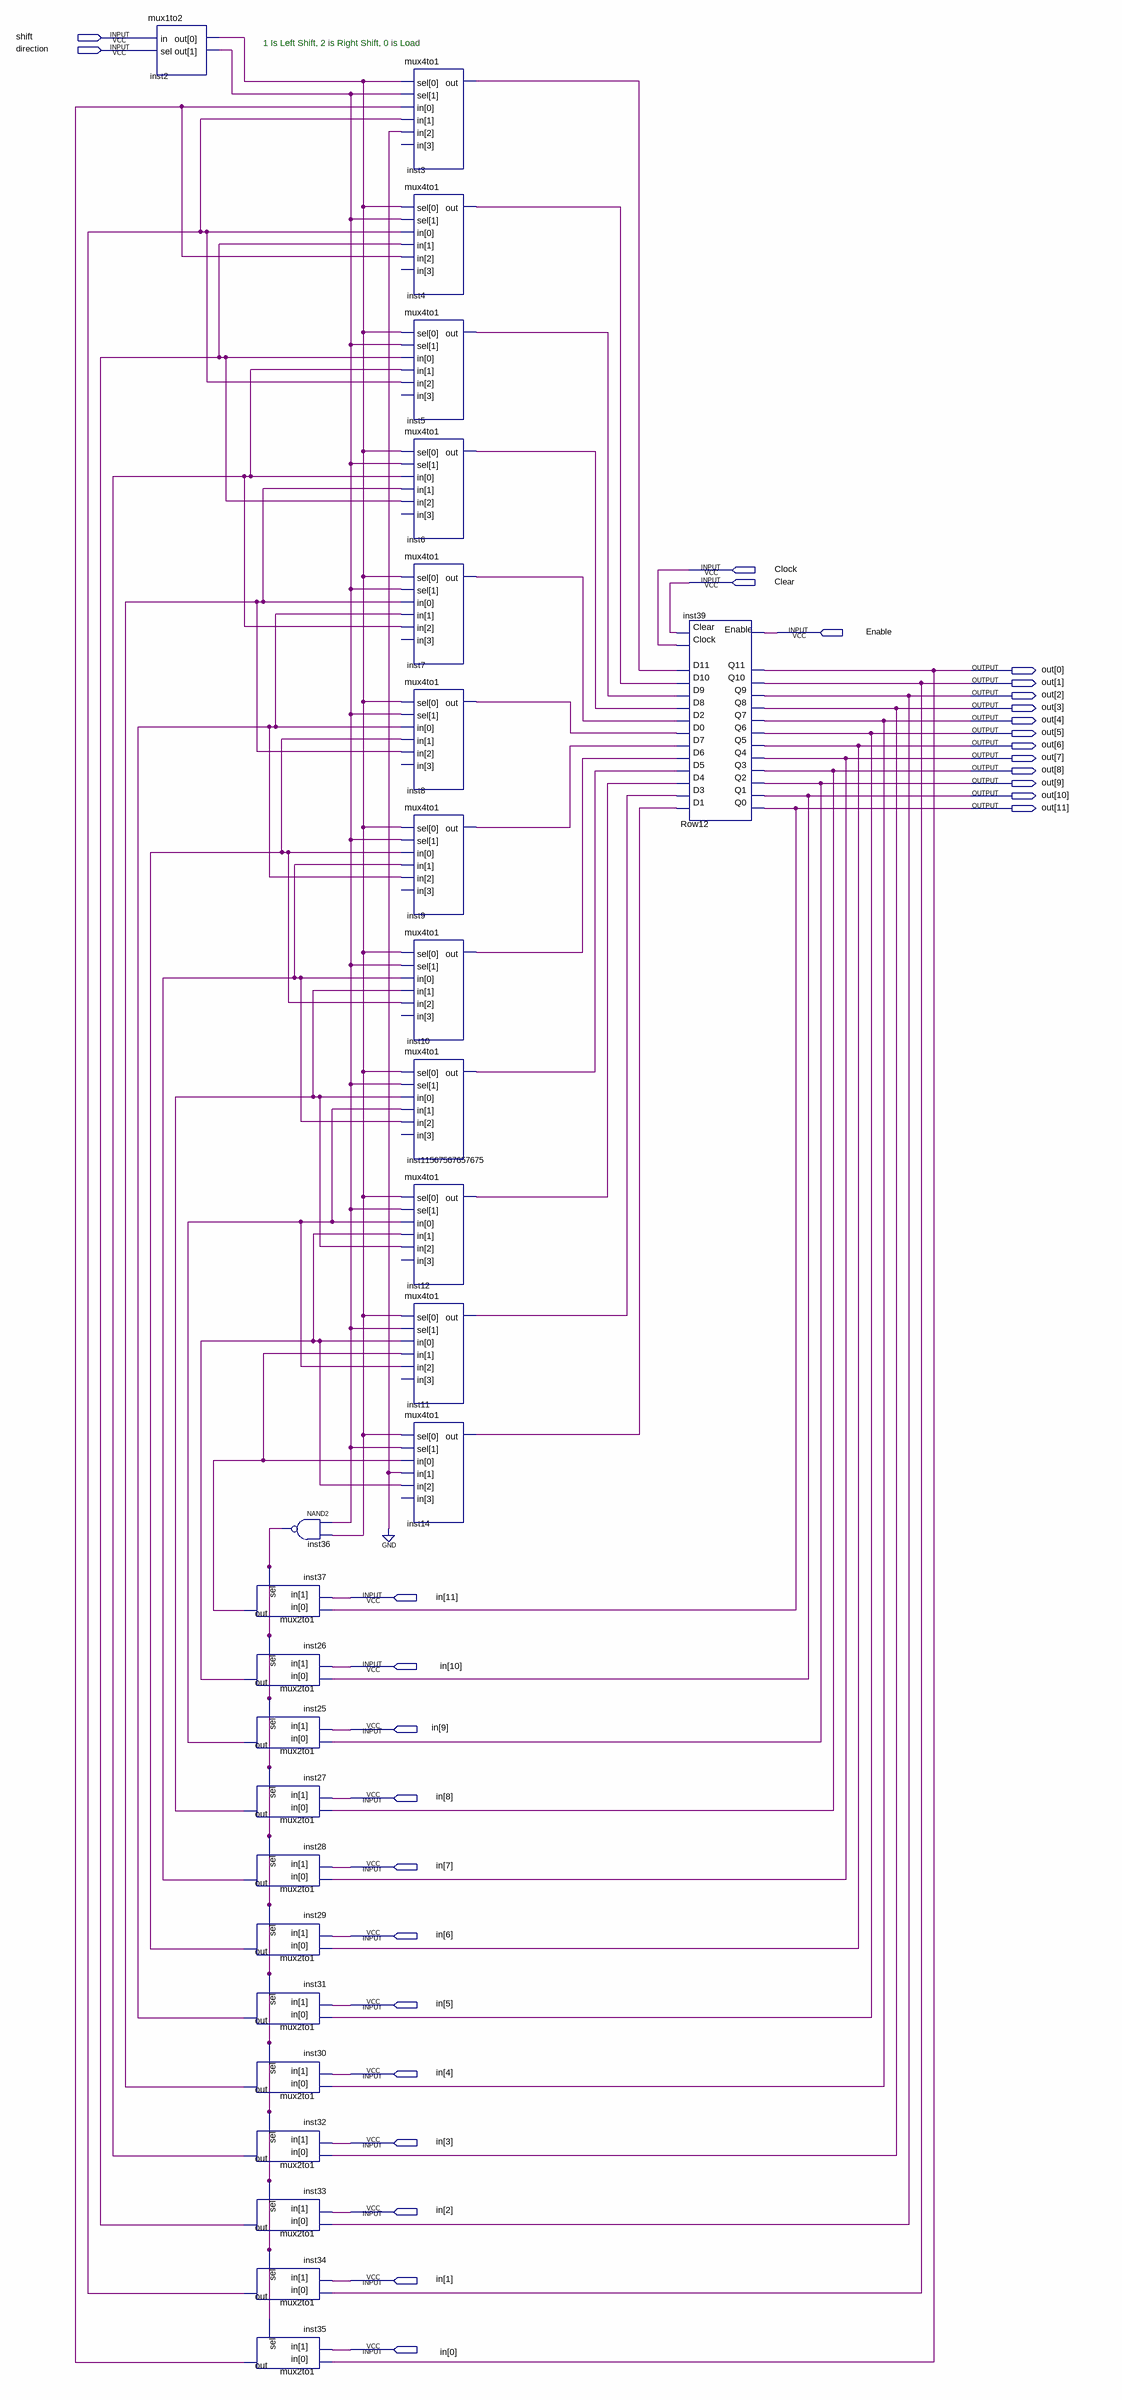
[diagram p0: schematic sheet]
// Quartus schematic shiftRow.bdf as structural Verilog: 27 symbols, 29 pins
module shiftRow (
  input  shift,
  input  direction,
  input  Clock,
  input  Clear,
  input  Enable,
  input  [11:0] in,
  output [11:0] out
);

  wire inst2_out, inst2_out_2, inst3_out, inst4_out, inst5_out, inst6_out, inst7_out, inst8_out, inst9_out,
       inst10_out, inst11_out, inst12_out, inst14_out, inst25_out, inst26_out, inst27_out, inst28_out,
       inst29_out, inst30_out, inst31_out, inst32_out, inst33_out, inst34_out, inst35_out, inst36_out,
       inst37_out, inst11567567657675_out;

  mux1to2 inst2 (.in(shift), .sel(direction), .out({inst2_out, inst2_out_2}));
  mux2to1 inst37 (.in({in[11], out[11]}), .sel(inst36_out), .out(inst37_out));
  mux2to1 inst26 (.in({in[10], out[10]}), .sel(inst36_out), .out(inst26_out));
  mux2to1 inst25 (.in({in[9], out[9]}), .sel(inst36_out), .out(inst25_out));
  mux2to1 inst27 (.in({in[8], out[8]}), .sel(inst36_out), .out(inst27_out));
  mux2to1 inst28 (.in({in[7], out[7]}), .sel(inst36_out), .out(inst28_out));
  mux2to1 inst29 (.in({in[6], out[6]}), .sel(inst36_out), .out(inst29_out));
  mux2to1 inst31 (.in({in[5], out[5]}), .sel(inst36_out), .out(inst31_out));
  mux2to1 inst30 (.in({in[4], out[4]}), .sel(inst36_out), .out(inst30_out));
  mux2to1 inst32 (.in({in[3], out[3]}), .sel(inst36_out), .out(inst32_out));
  mux2to1 inst33 (.in({in[2], out[2]}), .sel(inst36_out), .out(inst33_out));
  mux2to1 inst34 (.in({in[1], out[1]}), .sel(inst36_out), .out(inst34_out));
  mux2to1 inst35 (.in({in[0], out[0]}), .sel(inst36_out), .out(inst35_out));
  nand inst36 (inst36_out, inst2_out, inst2_out_2);
  mux4to1 inst3 (.sel({inst2_out, inst2_out_2}), .in({2'bz0, inst34_out, inst35_out}), .out(inst3_out));
  mux4to1 inst4 (.sel({inst2_out, inst2_out_2}), .in({1'bz, inst35_out, inst33_out, inst34_out}), .out(inst4_out));
  mux4to1 inst5 (.sel({inst2_out, inst2_out_2}), .in({1'bz, inst34_out, inst32_out, inst33_out}), .out(inst5_out));
  mux4to1 inst6 (.sel({inst2_out, inst2_out_2}), .in({1'bz, inst33_out, inst30_out, inst32_out}), .out(inst6_out));
  mux4to1 inst7 (.sel({inst2_out, inst2_out_2}), .in({1'bz, inst32_out, inst31_out, inst30_out}), .out(inst7_out));
  mux4to1 inst8 (.sel({inst2_out, inst2_out_2}), .in({1'bz, inst30_out, inst29_out, inst31_out}), .out(inst8_out));
  mux4to1 inst9 (.sel({inst2_out, inst2_out_2}), .in({1'bz, inst31_out, inst28_out, inst29_out}), .out(inst9_out));
  mux4to1 inst10 (.sel({inst2_out, inst2_out_2}), .in({1'bz, inst29_out, inst27_out, inst28_out}), .out(inst10_out));
  mux4to1 inst11567567657675 (
    .sel({inst2_out, inst2_out_2}), .in({1'bz, inst28_out, inst25_out, inst27_out}),
    .out(inst11567567657675_out));
  mux4to1 inst12 (.sel({inst2_out, inst2_out_2}), .in({1'bz, inst27_out, inst26_out, inst25_out}), .out(inst12_out));
  mux4to1 inst11 (.sel({inst2_out, inst2_out_2}), .in({1'bz, inst25_out, inst37_out, inst26_out}), .out(inst11_out));
  mux4to1 inst14 (.sel({inst2_out, inst2_out_2}), .in({1'bz, inst26_out, 1'b0, inst37_out}), .out(inst14_out));
  Row12 inst39 (
    .D1(inst14_out), .D3(inst11_out), .D4(inst12_out), .D5(inst11567567657675_out), .D6(inst10_out),
    .D7(inst9_out), .D0(inst8_out), .D2(inst7_out), .D8(inst6_out), .D9(inst5_out), .D10(inst4_out),
    .D11(inst3_out), .Clock(Clock), .Clear(Clear), .Enable(Enable), .Q0(out[11]), .Q1(out[10]), .Q2(out[9]),
    .Q3(out[8]), .Q4(out[7]), .Q5(out[6]), .Q6(out[5]), .Q7(out[4]), .Q8(out[3]), .Q9(out[2]), .Q10(out[1]),
    .Q11(out[0]));

  // Notes on the sheet:
  //   1 Is Left Shift, 2 is Right Shift, 0 is Load
endmodule
